# Altium schematic sheet communication.SchDoc
size A4; SheetNumber: 4; SheetTotal: 4
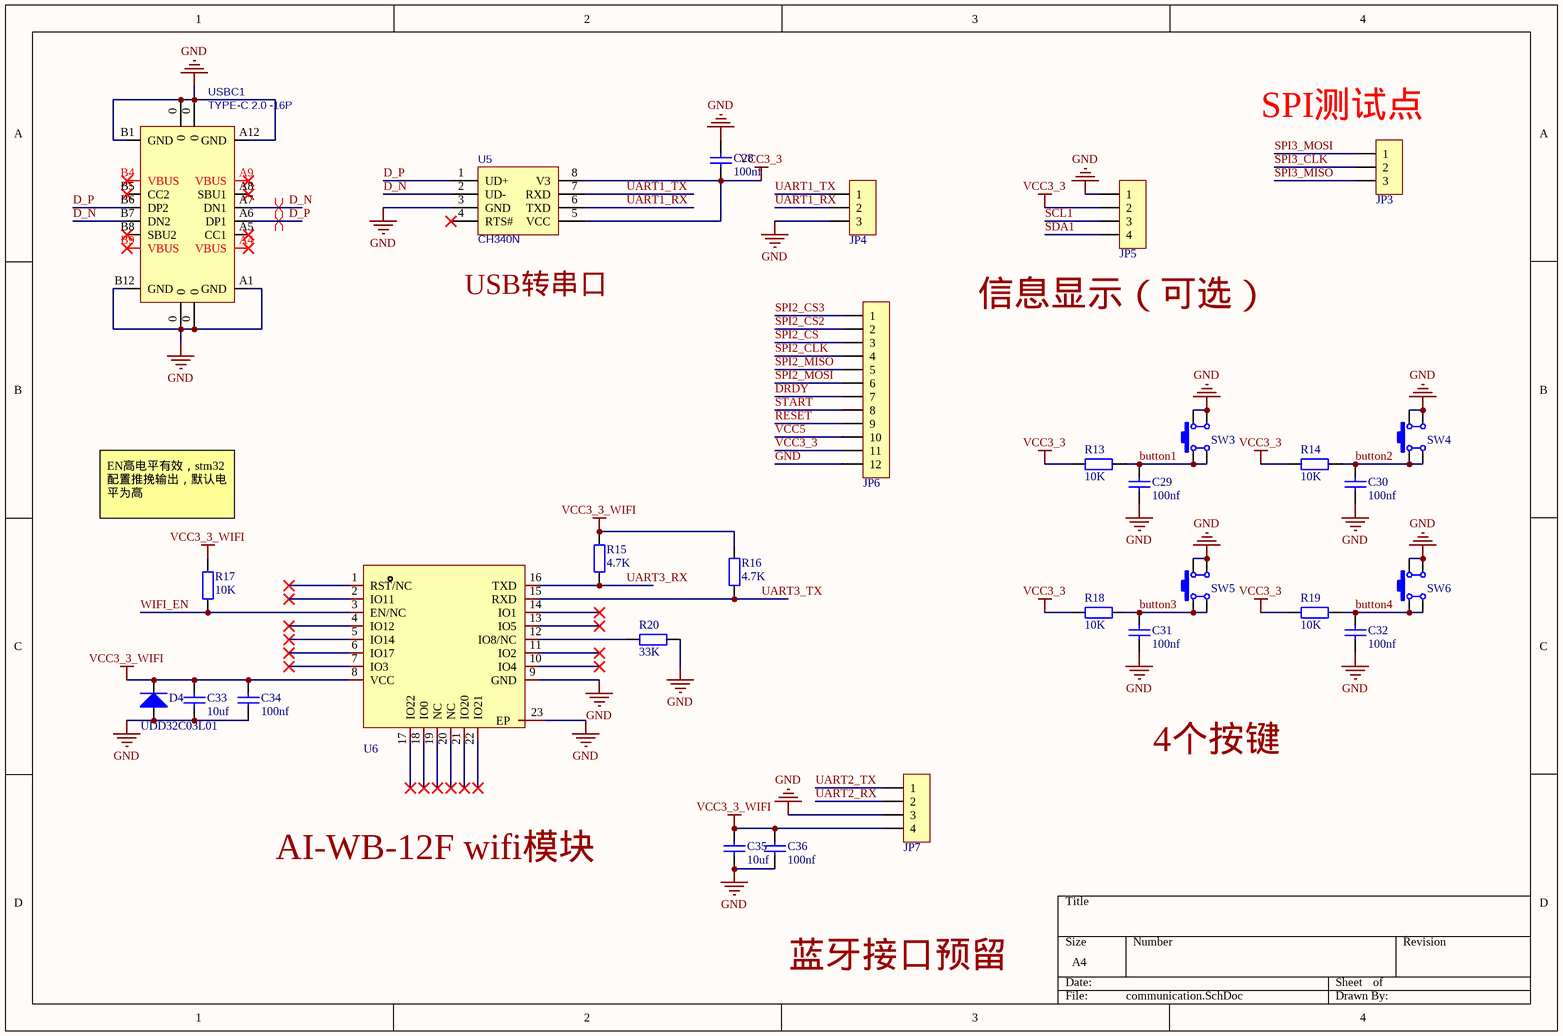
[diagram p0: communication.SchDoc]

## Parts
C28  100nf  [C0603_L]
C29  100nf  [C0603_L]
C30  100nf  [C0603_L]
C31  100nf  [C0603_L]
C32  100nf  [C0603_L]
C33  10uf  [C0603_L]
C34  100nf  [C0603_L]
C35  10uf  [C0603_L]
C36  100nf  [C0603_L]
D4  UDD32C03L01  [SOD-323]
JP3  HDR-1X3  [HDR2.54-LI-3P]  (value not drawn)
JP4  HDR-1X3  [HDR2.54-LI-3P]  (value not drawn)
JP5  HDR-1X4  [HDR2.54-M-LI-4P]  (value not drawn)
JP6  HDR-1X12  [HDR2.54-M-LI-12P]  (value not drawn)
JP7  HDR-1X4  [HDR2.54-M-LI-4P]  (value not drawn)
R13  10K  [R0603_L]
R14  10K  [R0603_L]
R15  4.7K  [R0402_L]
R16  4.7K  [R0402_L]
R17  10K  [R0402_L]
R18  10K  [R0603_L]
R19  10K  [R0603_L]
R20  33K  [R0402_L]
SW3  3*4*2.5  [SW-SMD-4.2x3.2_4P]  (value not drawn)
SW4  3*4*2.5  [SW-SMD-4.2x3.2_4P]  (value not drawn)
SW5  3*4*2.5  [SW-SMD-4.2x3.2_4P]  (value not drawn)
SW6  3*4*2.5  [SW-SMD-4.2x3.2_4P]  (value not drawn)
U5  CH340N  [SOIC-8]
U6  Ai-WB2-12F  [ai-wb-12f]  (value not drawn)
USBC1  TYPE-C 2.0 -16P  [USB-C-SMD_16P]

## Nets
GND: C28.2 C29.1 C30.1 C31.1 C32.1 C33.1 C34.1 C35.1 C36.1 D4.1(A) JP4.3 JP5.1 JP6.12 JP7.3 R20.1 SW3.2 SW3.3 SW4.2 SW4.3 SW5.2 SW5.3 SW6.2 SW6.3 U5.3(GND) U6.9(GND) U6.23(EP) USBC1.0 USBC1.A1(GND) USBC1.A12(GND) USBC1.B1(GND) USBC1.B12(GND)
VCC3_3: C28.1 JP5.2 JP6.11 R13.1 R14.1 R18.1 R19.1 U5.5(VCC) U5.8(V3)
VCC3_3_WIFI: C33.2 C34.2 C35.2 C36.2 D4.2(K) JP7.4 R15.1 R16.1 R17.2 U6.8(VCC)
button1: C29.2 R13.2 SW3.1 SW3.4
button2: C30.2 R14.2 SW4.1 SW4.4
button3: C31.2 R18.2 SW5.1 SW5.4
button4: C32.2 R19.2 SW6.1 SW6.4
D_N: U5.2(UD-) USBC1.A7(DN1) USBC1.B7(DN2)
D_P: U5.1(UD+) USBC1.A6(DP1) USBC1.B6(DP2)
DRDY: JP6.7
RESET: JP6.9
SCL1: JP5.3
SDA1: JP5.4
SPI2_CLK: JP6.4
SPI2_CS: JP6.3
SPI2_CS2: JP6.2
SPI2_CS3: JP6.1
SPI2_MISO: JP6.5
SPI2_MOSI: JP6.6
SPI3_CLK: JP3.2
SPI3_MISO: JP3.3
SPI3_MOSI: JP3.1
START: JP6.8
UART1_RX: JP4.2 U5.6(TXD)
UART1_TX: JP4.1 U5.7(RXD)
UART2_RX: JP7.2
UART2_TX: JP7.1
UART3_RX: R15.2 U6.16(TXD)
UART3_TX: R16.2 U6.15(RXD)
VCC5: JP6.10
WIFI_EN: R17.1 U6.3(EN/NC)
NetR20_2: R20.2 U6.12(IO8/NC)

Not connected (* = marked no-connect by the designer): U5 4(RTS#)*; U6 1(RST/NC)* 2(IO11)* 4(IO12)* 5(IO14)* 6(IO17)* 7(IO3)* 10(IO4)* 11(IO2)* 13(IO5)* 14(IO1)* 17(IO22)* 18(IO0)* 19(NC)* 20(NC)* 21(IO20)* 22(IO21)*; USBC1 A4(VBUS)* A5(CC1)* A8(SBU1)* A9(VBUS)* B4(VBUS)* B5(CC2)* B8(SBU2)* B9(VBUS)*

## Layout directives
differential pair: D_N, D_P

## Notes on the sheet
- (near JP3) SPI测试点
- (near U5) USB转串口
- (near JP5) 信息显示（可选）
- EN高电平有效，stm32配置推挽输出，默认电平为高
- 4个按键
- AI-WB-12F wifi模块
- 蓝牙接口预留

## Library data of the parts
C28-C36 = C: 贴片电容/MLCC电容; BOM名称: 无极性贴片电容; 联系下单店铺卖家 免费帮你查找封装: 联系下单店铺卖家 免费技术指导
D4 = UDD32C03L01: 静电和浪涌保护 3.3V双向; jlc_id: C78439
JP3 JP4 = Header 3: 3P接插件; 联系卖家，免费查找封装: 唯一出售店铺网址https://shop463601444.taobao.com; 封装库来自淘宝卖家ID：黄晶宝石: 其他店铺购入均为盗版封装库，请立即申请退款，本店现金奖励50~200元; BOM名称: 3P接插件
JP5 JP7 = Header 4: 4P接插件; 联系卖家，免费查找封装: 唯一出售店铺网址https://shop463601444.taobao.com; 封装库来自淘宝卖家ID：黄晶宝石: 其他店铺购入均为盗版封装库，请立即申请退款，本店现金奖励50~200元; BOM名称: 4P接插件
JP6 = Header 12: 12P接插件; 联系卖家，免费查找封装: 唯一出售店铺网址https://shop463601444.taobao.com; 封装库来自淘宝卖家ID：黄晶宝石: 其他店铺购入均为盗版封装库，请立即申请退款，本店现金奖励50~200元; BOM名称: 12P接插件
R13-R20 = R: 贴片电阻; 联系下单店铺卖家 免费帮你查找封装: 联系下单店铺卖家 免费技术指导; BOM名称: 贴片电阻
SW3-SW6 = SW SMD-3*4*2.5: 贴片4脚轻触开关; 联系下单店铺卖家 免费技术支持: 联系下单店铺卖家 免费帮你查找封装
U5 = CH340N: USB转串口芯片, 内置晶振; 封装库来自淘宝卖家：黄晶宝石: 其他店铺购入均为盗版封装库，无更新权益，请立即申请退款，联系卖家：黄晶宝石 获取现金奖励200~5000元
U6 = Ai-WB2-12F: esp32-12f的替代 2.4g wifi和蓝牙; Manufacturer: Ai-Thinker(安信可); Add into BOM: yes; Core Processor: BL602芯片; Wireless Standard: 802.11b/g/n；BLE5.0; Support Interface: I2C；GPIO；UART；PWM；SPI；ADC; Value: 2.4GHz; Antenna Type: 板载PCB天线; Output Power: 16dBm; Operating Voltage: 3.3V; Receive  Current: 65mA; Send  Current: 260mA; Sensitivity: -98dBm; Symbol: AI-WB2-12F; Device: Ai-WB2-12F; LCSC Part Name: Ai- WB2- 12F; Supplier Part: C5187541; Manufacturer Part: Ai-WB2-12F; Supplier Footprint: SMD-22P; JLCPCB Part Class: 扩展库; Datasheet: https://atta.szlcsc.com/upload/public/pdf/source/20221011/A82852E3370C90F4DD91995C889100A2.pdf; Supplier: LCSC; Convert to PCB: yes; Operating Temperature: -40℃~+85℃
USBC1 = USB2.0_Type-C_16Pin: USB2.0_Type-C_16Pin母座 C2765186; 当前库版本V2024.2.3 @淘宝卖家:黄晶宝石: 最新版本发布https://item.taobao.com/item.htm?id=566775463719